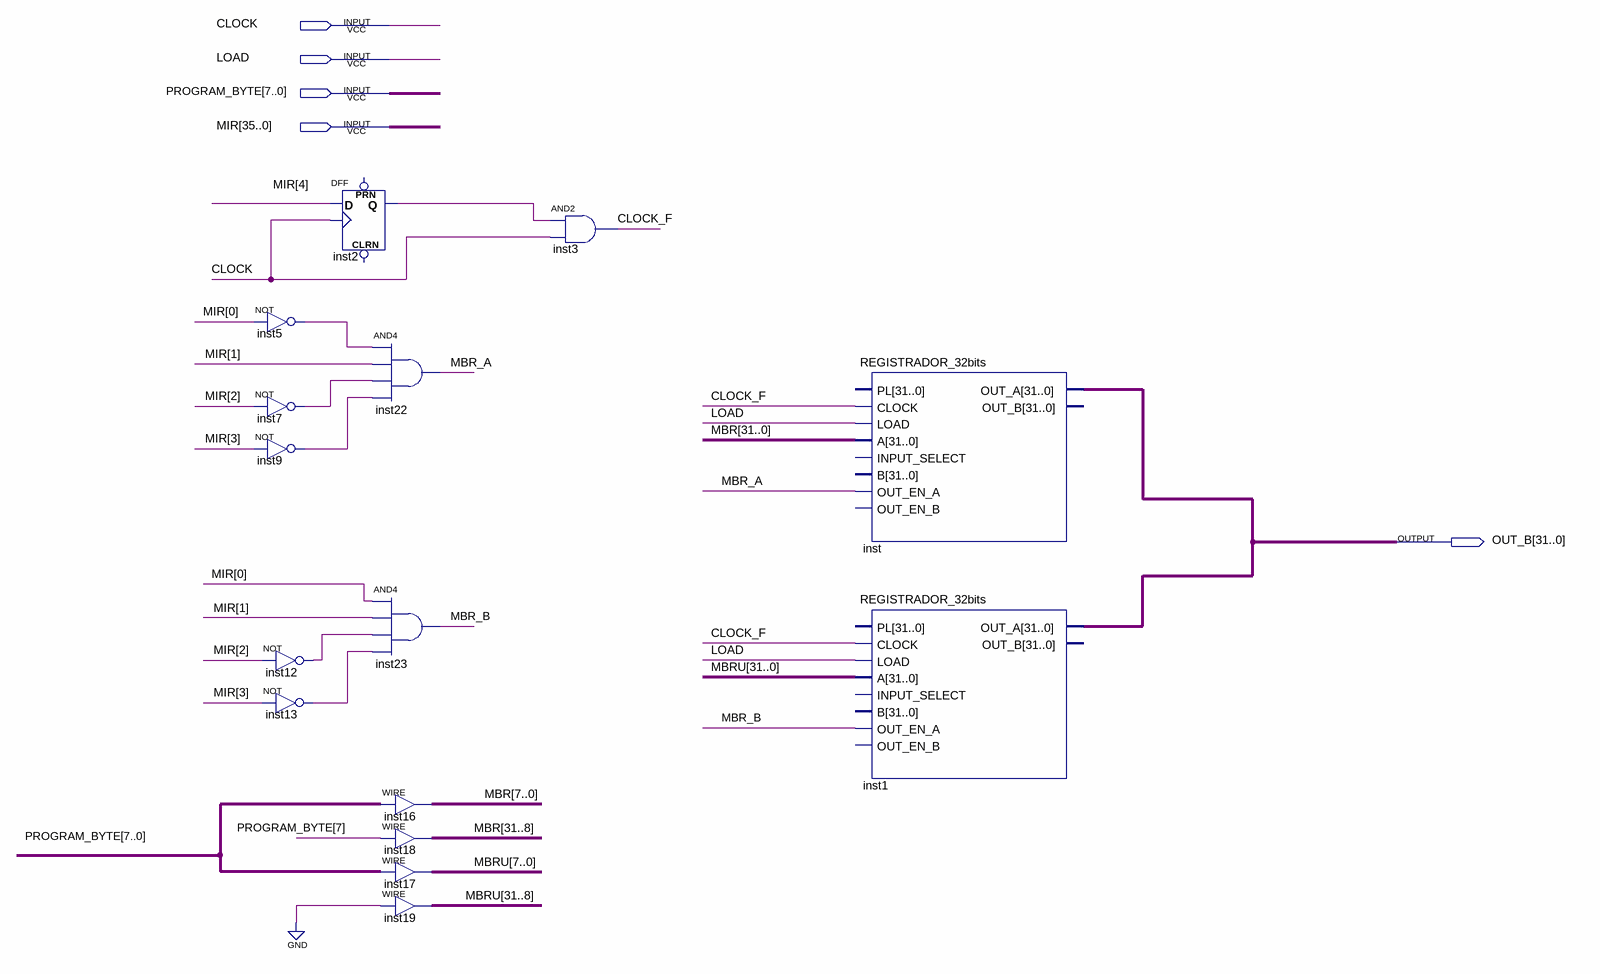
[diagram p0: schematic sheet]
// Quartus schematic MBR.bdf as structural Verilog: 15 symbols, 5 pins
module MBR (
  input  CLOCK,
  input  LOAD,
  input  [7:0] PROGRAM_BYTE,
  input  [35:0] MIR,
  output [31:0] OUT_B
);

  wire CLOCK_F, inst2_q, inst5_out, inst7_out, inst9_out, inst12_out, inst13_out, MBR_A, MBR_B;
  wire [31:0] MBR, MBRU;

  not inst5 (inst5_out, MIR[0]);
  not inst7 (inst7_out, MIR[2]);
  not inst9 (inst9_out, MIR[3]);
  not inst12 (inst12_out, MIR[2]);
  not inst13 (inst13_out, MIR[3]);
  DFF inst2 (.CLK(CLOCK), .D(MIR[4]), .Q(inst2_q));  // open: CLRN, PRN
  and inst22 (MBR_A, inst5_out, MIR[1], inst7_out, inst9_out);
  and inst23 (MBR_B, MIR[0], MIR[1], inst12_out, inst13_out);
  assign MBR[7:0] = PROGRAM_BYTE;  // WIRE inst16
  assign MBR[31:8] = {24{PROGRAM_BYTE[7]}};  // WIRE inst18
  assign MBRU[7:0] = PROGRAM_BYTE;  // WIRE inst17
  assign MBRU[31:8] = {24{1'b0}};  // WIRE inst19
  and inst3 (CLOCK_F, inst2_q, CLOCK);
  REGISTRADOR_32bits inst (
    .CLOCK(CLOCK_F), .LOAD(LOAD), .A(MBR), .OUT_EN_A(MBR_A), .OUT_A(OUT_B));  // open: PL, INPUT_SELECT, B, OUT_EN_B, OUT_B
  REGISTRADOR_32bits inst1 (
    .CLOCK(CLOCK_F), .LOAD(LOAD), .A(MBRU), .OUT_EN_A(MBR_B), .OUT_A(OUT_B));  // open: PL, INPUT_SELECT, B, OUT_EN_B, OUT_B
endmodule
